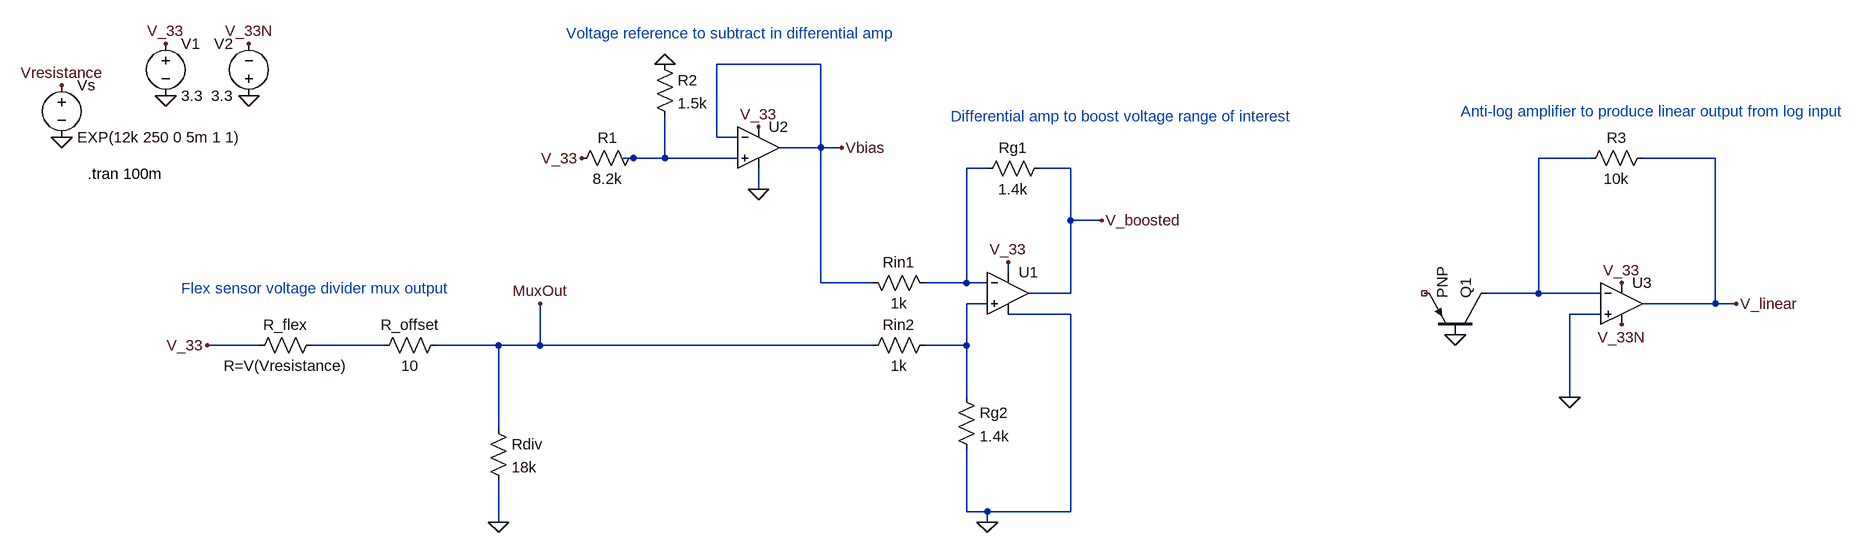
[diagram p0: schematic Flex Sensor to ADC.asc]
Flex Sensor to ADC.asc, the LTspice schematic file:
Version 4
SHEET 1 2596 680
WIRE 944 -240 784 -240
WIRE 784 -128 784 -240
WIRE 816 -128 784 -128
WIRE 944 -112 944 -240
WIRE 944 -112 880 -112
WIRE 976 -112 944 -112
WIRE 656 -96 640 -96
WIRE 704 -96 704 -160
WIRE 704 -96 656 -96
WIRE 816 -96 704 -96
WIRE 2128 -96 2048 -96
WIRE 2320 -96 2208 -96
WIRE 1200 -80 1168 -80
WIRE 1328 -80 1280 -80
WIRE 848 -48 848 -80
WIRE 1328 0 1328 -80
WIRE 1376 0 1328 0
WIRE 1232 80 1232 64
WIRE 944 96 944 -112
WIRE 1024 96 944 96
WIRE 1168 96 1168 -80
WIRE 1168 96 1104 96
WIRE 1200 96 1168 96
WIRE 1328 112 1328 0
WIRE 1328 112 1264 112
WIRE 2048 112 2048 -96
WIRE 2048 112 1968 112
WIRE 2144 112 2048 112
WIRE 1200 128 1168 128
WIRE 2320 128 2320 -96
WIRE 2320 128 2208 128
WIRE 2352 128 2320 128
WIRE 1328 144 1232 144
WIRE 2144 144 2096 144
WIRE 80 192 0 192
WIRE 272 192 160 192
WIRE 448 192 352 192
WIRE 512 192 512 128
WIRE 512 192 448 192
WIRE 1024 192 512 192
WIRE 1168 192 1168 128
WIRE 1168 192 1104 192
WIRE 1168 272 1168 192
WIRE 2096 272 2096 144
WIRE 448 320 448 192
WIRE 1168 448 1168 352
WIRE 1200 448 1168 448
WIRE 1328 448 1328 144
WIRE 1328 448 1200 448
WIRE 448 464 448 400
WIRE 1200 464 1200 448
FLAG -64 -192 0
FLAG 448 464 0
FLAG -224 -128 0
FLAG -224 -208 Vresistance
FLAG 512 128 MuxOut
FLAG 1232 64 V_33
FLAG -64 -272 V_33
FLAG 0 192 V_33
FLAG 1200 464 0
FLAG 576 -96 V_33
FLAG 704 -240 0
FLAG 848 -144 V_33
FLAG 848 -48 0
FLAG 976 -112 Vbias
FLAG 1376 0 V_boosted
FLAG 2176 96 V_33
FLAG 2352 128 V_linear
FLAG 1920 176 0
FLAG 64 -192 0
FLAG 64 -272 V_33N
FLAG 2176 160 V_33N
FLAG 2096 272 0
SYMBOL res 176 176 R90
WINDOW 0 0 56 VBottom 2
WINDOW 3 32 56 VTop 2
SYMATTR InstName R_flex
SYMATTR Value R=V(Vresistance)
SYMBOL voltage -64 -288 R0
SYMATTR InstName V1
SYMATTR Value 3.3
SYMBOL res 432 304 R0
SYMATTR InstName Rdiv
SYMATTR Value 18k
SYMBOL res 368 176 R90
WINDOW 0 0 56 VBottom 2
WINDOW 3 32 56 VTop 2
SYMATTR InstName R_offset
SYMATTR Value 10
SYMBOL voltage -224 -224 R0
WINDOW 123 0 0 Left 0
WINDOW 39 0 0 Left 0
SYMATTR InstName Vs
SYMATTR Value EXP(12k 250 0 5m 1 1)
SYMBOL res 1008 80 M90
WINDOW 0 0 56 VBottom 2
WINDOW 3 32 56 VTop 2
SYMATTR InstName Rin1
SYMATTR Value 1k
SYMBOL OpAmps\\UniversalOpamp2 1232 112 R0
SYMATTR InstName U1
SYMBOL res 1296 -96 R90
WINDOW 0 0 56 VBottom 2
WINDOW 3 32 56 VTop 2
SYMATTR InstName Rg1
SYMATTR Value 1.4k
SYMBOL res 1152 256 R0
SYMATTR InstName Rg2
SYMATTR Value 1.4k
SYMBOL res 1120 176 R90
WINDOW 0 0 56 VBottom 2
WINDOW 3 32 56 VTop 2
SYMATTR InstName Rin2
SYMATTR Value 1k
SYMBOL res 688 -256 R0
SYMATTR InstName R2
SYMATTR Value 1.5k
SYMBOL res 672 -112 R90
WINDOW 0 0 56 VBottom 2
WINDOW 3 32 56 VTop 2
SYMATTR InstName R1
SYMATTR Value 8.2k
SYMBOL OpAmps\\UniversalOpamp2 848 -112 R0
SYMATTR InstName U2
SYMBOL OpAmps\\UniversalOpamp2 2176 128 R0
SYMATTR InstName U3
SYMBOL pnp 1968 176 M270
SYMATTR InstName Q1
SYMBOL res 2224 -112 R90
WINDOW 0 0 56 VBottom 2
WINDOW 3 32 56 VTop 2
SYMATTR InstName R3
SYMATTR Value 10k
SYMBOL voltage 64 -176 R180
WINDOW 0 24 96 Left 2
WINDOW 3 24 16 Left 2
SYMATTR InstName V2
SYMATTR Value 3.3
TEXT -40 104 Left 2 ;Flex sensor voltage divider mux output
TEXT -184 -72 Left 2 !.tran 100m
TEXT 552 -288 Left 2 ;Voltage reference to subtract in differential amp
TEXT 1144 -160 Left 2 ;Differential amp to boost voltage range of interest
TEXT 1928 -168 Left 2 ;Anti-log amplifier to produce linear output from log input

The netlist it stands for:
* Flex Sensor to ADC.asc
R_flex N005 V_33 R=V(Vresistance)
V1 V_33 0 3.3
Rdiv MuxOut 0 18k
R_offset MuxOut N005 10
Vs Vresistance 0 EXP(12k 250 0 5m 1 1)
Rin1 Vbias N003 1k
XU1 N004 N003 V_33 0 V_boosted level.2 Avol=1Meg GBW=10Meg Slew=10Meg ilimit=25m rail=0 Vos=0 phimargin=45 en=0 enk=0 in=0 ink=0 Rin=500Meg  ; pins IN+ IN- V+ V- OUT
Rg1 V_boosted N003 1.4k
Rg2 N004 0 1.4k
Rin2 N004 MuxOut 1k
R2 0 N001 1.5k
R1 N001 V_33 8.2k
XU2 N001 Vbias V_33 0 Vbias level.2 Avol=1Meg GBW=10Meg Slew=10Meg ilimit=25m rail=0 Vos=0 phimargin=45 en=0 enk=0 in=0 ink=0 Rin=500Meg  ; pins IN+ IN- V+ V- OUT
XU3 0 N002 V_33 V_33N V_linear level.2 Avol=1Meg GBW=10Meg Slew=10Meg ilimit=25m rail=0 Vos=0 phimargin=45 en=0 enk=0 in=0 ink=0 Rin=500Meg  ; pins IN+ IN- V+ V- OUT
Q1 N002 0 NC_01 0 PNP
R3 V_linear N002 10k
V2 0 V_33N 3.3
.model NPN NPN
.model PNP PNP
.lib standard.bjt
* Flex sensor voltage divider mux output
.tran 100m
* Voltage reference to subtract in differential amp
* Differential amp to boost voltage range of interest
* Anti-log amplifier to produce linear output from log input
.lib UniversalOpamps2.sub
.backanno
.end